# Altium schematic sheet TTL.SchDoc
size A; SheetNumber: 12; SheetTotal: 14
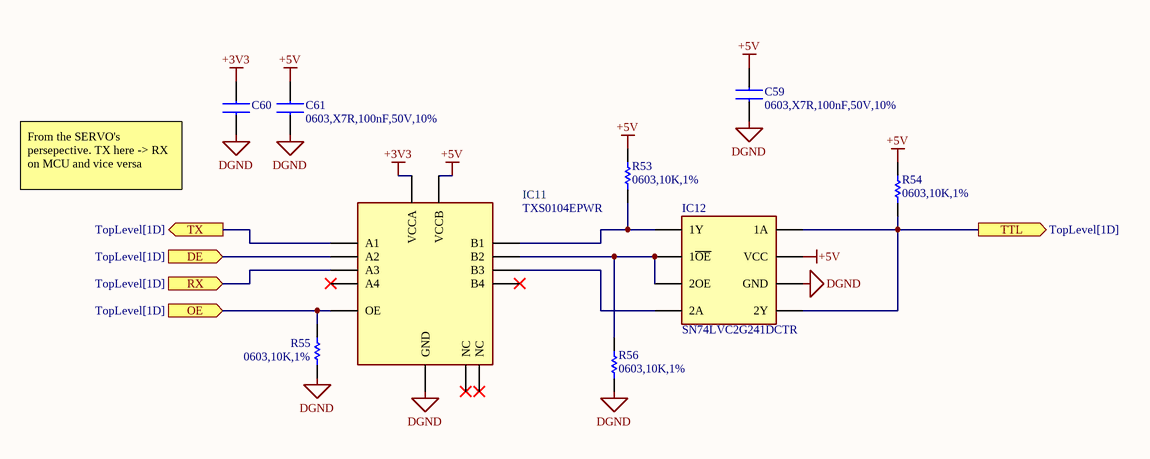
[diagram p0: TTL.SchDoc]

## Parts
C59  0603,X7R,100nF,50V,10%  [CAPC1608X90N]
C60  0603,X7R,100nF,50V,10%  [CAPC1608X90N]  (value not drawn)
C61  0603,X7R,100nF,50V,10%  [CAPC1608X90N]
IC11  TXS0104EPWR  [TXB0104PWR]
IC12  SN74LVC2G241DCTR  [SOP65P400X130-8N]
R53  0603,10K,1%  [RESC1608X90N]
R54  0603,10K,1%  [RESC1608X90N]
R55  0603,10K,1%  [RESC1608X90N]
R56  0603,10K,1%  [RESC1608X90N]

## Ports
DE (in, see TopLevel[1D]), OE (in, see TopLevel[1D]), RX (in, see TopLevel[1D]), TTL (out, see TopLevel[1D]), TX (out, see TopLevel[1D])

## Nets
+3V3: C60.2 IC11.1(VCCA)
+5V: C59.2 C61.2 IC11.14(VCCB) IC12.8(VCC) R53.2 R54.2
DGND: C59.1 C60.1 C61.1 IC11.7(GND) IC12.4(GND) R55.1 R56.1
DE: IC11.3(A2) ; port DE
OE: IC11.8(OE) R55.2 ; port OE
RX: IC11.4(A3) ; port RX
TTL: IC12.2(1A) IC12.3(2Y) R54.1 ; port TTL
TX: IC11.2(A1) ; port TX
NetIC11_11: IC11.11(B3) IC12.5(2A)
NetIC11_12: IC11.12(B2) IC12.1(1~{OE}) IC12.7(2OE) R56.2
NetIC11_13: IC11.13(B1) IC12.6(1Y) R53.1

Not connected (* = marked no-connect by the designer): IC11 5(A4)* 6(NC)* 9(NC)* 10(B4)*

## Notes on the sheet
- From the SERVO's persepective. TX here -> RX on MCU and vice versa

## Library data of the parts
C59-C61 = CC0603KRX7R9BB104: 50V 100nF X7R ±10% 0603 Multilayer Ceramic Capacitors MLCC - SMD/SMT ROHS; LCSC Part #: C14663; Manu Part #: CC0603KRX7R9BB104
IC11 = TXS0104EPWR: 4-Bit Bidirectional Voltage-Level Translator For Open-Drain and Push-Pull Applications; LCSC Part #: C44955; Manu Part #: TXS0104EPWR
IC12 = SN74LVC2G241DCTR: SN74LVC2G241 Dual Buffer and Driver with Three-State Outputs; Manu Part #: SN74LVC2G241DCTR; LCSC Part #: C2676069
R53-R56 = 0603WAF1002T5E: 100mW Thick Film Resistor 75V ±100ppm/℃ ±1% 10kΩ 0603 Chip Resistor - Surface Mount ROHS; LCSC Part #: C25804; Manu Part #: 0603WAF1002T5E